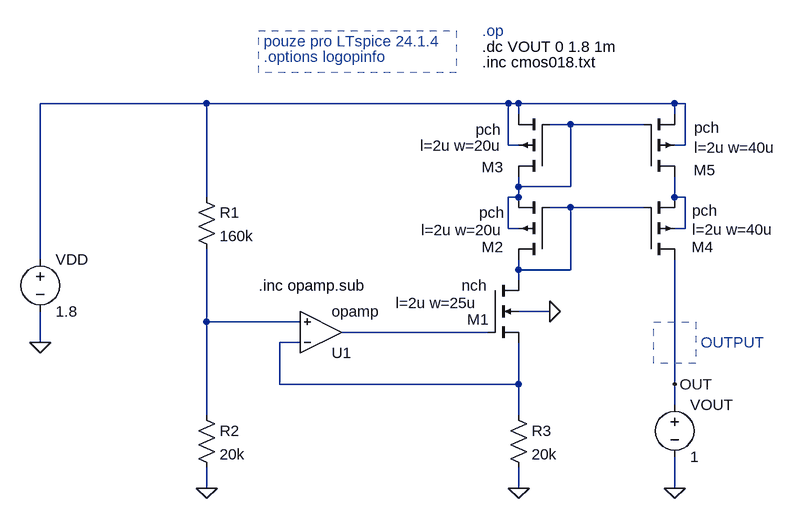
[diagram p0: schematic 1_KPZ.asc]
1_KPZ.asc, the LTspice schematic file:
Version 4
SHEET 1 1180 952
WIRE -304 240 -560 240
WIRE 160 240 -304 240
WIRE 176 240 160 240
WIRE 416 240 176 240
WIRE 432 240 416 240
WIRE 176 256 176 240
WIRE 416 256 416 240
WIRE 256 272 224 272
WIRE 368 272 256 272
WIRE 160 304 160 240
WIRE 176 304 160 304
WIRE 432 304 432 240
WIRE 432 304 416 304
WIRE 176 368 176 352
WIRE 256 368 256 272
WIRE 256 368 176 368
WIRE -304 384 -304 240
WIRE 176 384 176 368
WIRE 176 384 160 384
WIRE 416 384 416 352
WIRE 432 384 416 384
WIRE 256 400 224 400
WIRE 368 400 256 400
WIRE 160 432 160 384
WIRE 176 432 160 432
WIRE 432 432 432 384
WIRE 432 432 416 432
WIRE -560 480 -560 240
WIRE 176 496 176 480
WIRE 256 496 256 400
WIRE 256 496 176 496
WIRE 176 512 176 496
WIRE 224 560 176 560
WIRE -304 576 -304 464
WIRE -160 576 -304 576
WIRE 128 592 -96 592
WIRE -560 608 -560 560
WIRE -160 608 -192 608
WIRE -192 672 -192 608
WIRE 176 672 176 608
WIRE 176 672 -192 672
WIRE 416 672 416 480
WIRE 416 704 416 672
WIRE -304 720 -304 576
WIRE 176 720 176 672
WIRE -304 832 -304 800
WIRE 176 832 176 800
WIRE 416 832 416 784
FLAG 416 832 0
FLAG 416 672 OUT
FLAG -560 608 0
FLAG -304 832 0
FLAG 176 832 0
FLAG 224 560 0
DATAFLAG -256 576 "round($*1e4)/1e4"
DATAFLAG 0 592 "round($*1e4)/1e4"
DATAFLAG 96 672 "round($*1e4)/1e4"
DATAFLAG 304 400 "round($*1e4)/1e4"
DATAFLAG 192 240 "round(Is(M3)*10e6)/10e6"
DATAFLAG 416 240 "round(Is(M5)*10e6)/10e6"
DATAFLAG 304 272 ""
SYMBOL voltage 416 688 R0
SYMATTR InstName VOUT
SYMATTR Value 1
SYMBOL voltage -560 464 R0
SYMATTR InstName VDD
SYMATTR Value 1.8
SYMBOL nmos4 128 512 R0
WINDOW 123 -141 35 Left 2
WINDOW 0 -31 60 Left 2
WINDOW 3 -40 8 Left 2
SYMATTR Value2 l=2u w=25u
SYMATTR InstName M1
SYMATTR Value nch
SYMBOL OpAmps\\opamp -128 656 M180
SYMATTR InstName U1
SYMBOL res -320 368 R0
SYMATTR InstName R1
SYMATTR Value 160k
SYMBOL res -320 704 R0
SYMATTR InstName R2
SYMATTR Value 20k
SYMBOL res 160 704 R0
SYMATTR InstName R3
SYMATTR Value 20k
SYMBOL pmos4 224 480 R180
WINDOW 123 73 45 Left 2
WINDOW 0 71 19 Left 2
WINDOW 3 70 72 Left 2
SYMATTR Value2 l=2u w=20u
SYMATTR InstName M2
SYMATTR Value pch
SYMBOL pmos4 224 352 R180
WINDOW 123 74 47 Left 2
WINDOW 0 71 14 Left 2
WINDOW 3 75 72 Left 2
SYMATTR Value2 l=2u w=20u
SYMATTR InstName M3
SYMATTR Value pch
SYMBOL pmos4 368 480 M180
WINDOW 123 75 46 Left 2
WINDOW 0 74 19 Left 2
WINDOW 3 75 75 Left 2
SYMATTR Value2 l=2u w=40u
SYMATTR InstName M4
SYMATTR Value pch
SYMBOL pmos4 368 352 M180
WINDOW 123 78 44 Left 2
WINDOW 0 77 10 Left 2
WINDOW 3 78 75 Left 2
SYMATTR Value2 l=2u w=40u
SYMATTR InstName M5
SYMATTR Value pch
TEXT 120 176 Left 2 !.inc cmos018.txt
TEXT 120 152 Left 2 !.dc VOUT 0 1.8 1m
TEXT 120 128 Left 2 ;.op
TEXT -216 168 Left 2 ;.options logopinfo
TEXT -224 520 Left 2 !.inc opamp.sub
TEXT 456 608 Left 2 ;OUTPUT
TEXT -216 144 Left 2 ;pouze pro LTspice 24.1.4
RECTANGLE Normal 448 640 384 576 2
RECTANGLE Normal 80 192 -224 128 2

The netlist it stands for:
* 1_KPZ.asc
VOUT OUT 0 1
VDD N001 0 1.8
M1 N004 N006 N007 0 nch l=2u w=25u
XU1 N007 N005 N006 opamp Aol=100K GBW=10Meg  ; pins invin noninvin out
R1 N001 N005 160k
R2 N005 0 20k
R3 N007 0 20k
M2 N004 N004 N002 N002 pch l=2u w=20u
M3 N002 N002 N001 N001 pch l=2u w=20u
M4 OUT N004 N003 N003 pch l=2u w=40u
M5 N003 N002 N001 N001 pch l=2u w=40u
.model NMOS NMOS
.model PMOS PMOS
.lib standard.mos
.inc cmos018.txt
.dc VOUT 0 1.8 1m
* .op
* .options logopinfo
.inc opamp.sub
* OUTPUT
* pouze pro LTspice 24.1.4
.backanno
.end